# EAGLE design STML451RE_Buck_HSI (EAGLE 9.6.2)

## Sheet 1 of 2
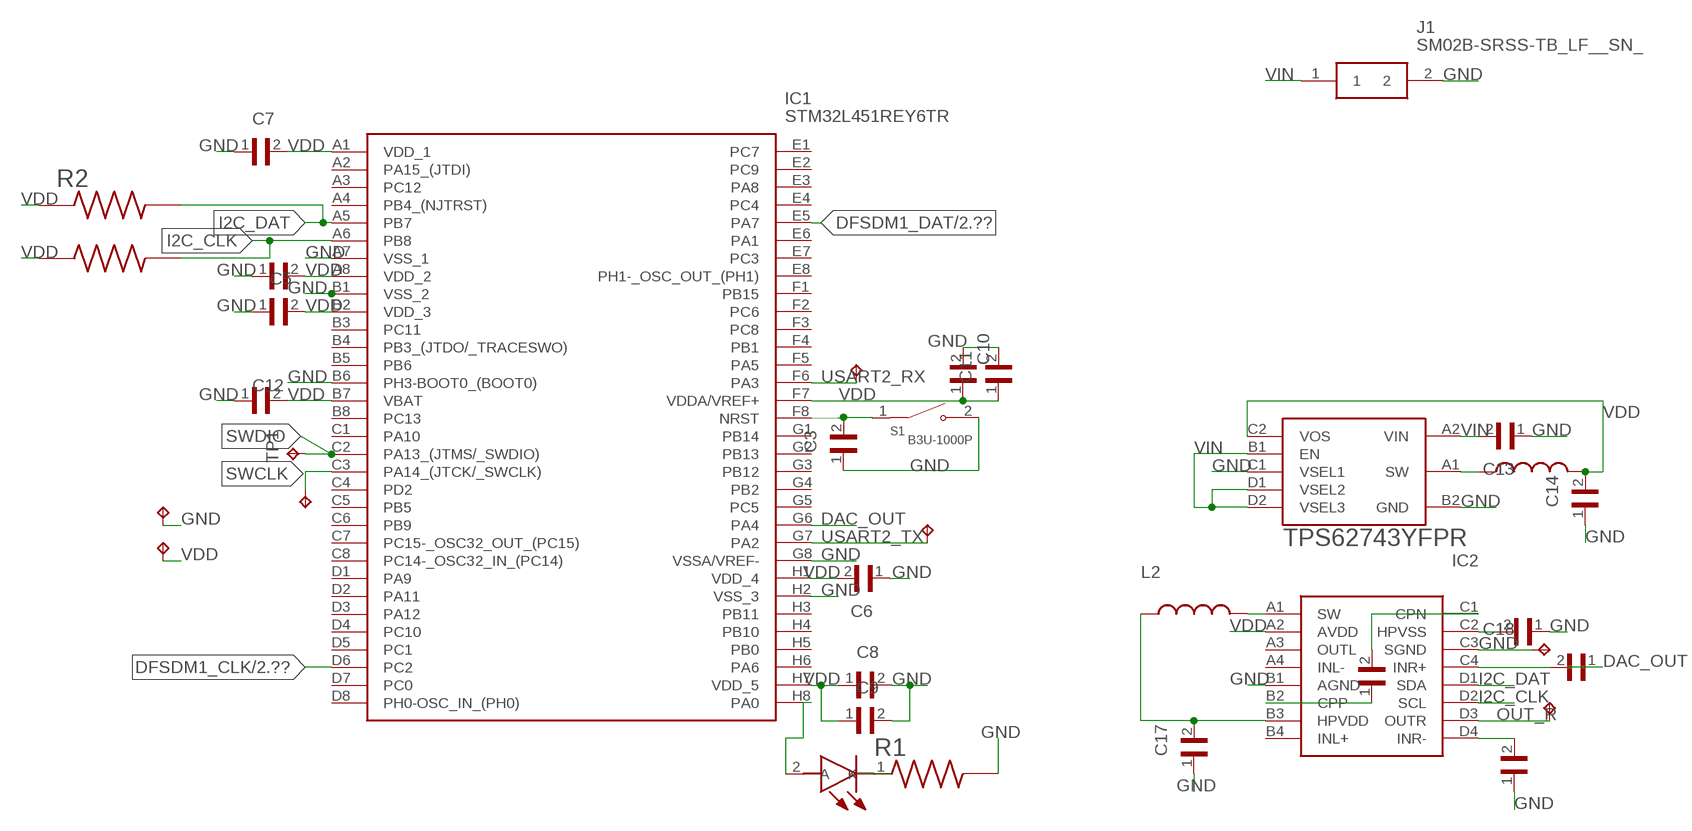
[diagram p0: schematic, sheet 1]

### Parts
C3  GRM033C80J104KE15D  [CAPC0603X33N]
C4  GRM033C80J104KE15D  [CAPC0603X33N]
C5  GRM033C80J104KE15D  [CAPC0603X33N]
C6  GRM033C80J104KE15D  [CAPC0603X33N]
C7  GRM033C80J104KE15D  [CAPC0603X33N]
C8  GRM033C80J104KE15D  [CAPC0603X33N]
C9  GRM155R60J475ME47D  [CAPC1005X60N]
C10  GRM033C80J104KE15D  [CAPC0603X33N]
C11  JMK105C6105KV-F  [CAPC1005X55N]
C12  GRM033C80J104KE15D  [CAPC0603X33N]
C13  GRM155R60J475ME47D  [CAPC1005X60N]
C14  GRM155R60J106ME15D  [CAPC1005X65N]
C17  GRM155R60J225KE95D  [CAPC1005X55N]
C18  GRM155R60J225KE95D  [CAPC1005X55N]
C19  JMK105C6105KV-F  [CAPC1005X55N]
C20  JMK105C6105KV-F  [CAPC1005X55N]
C21  JMK105C6105KV-F  [CAPC1005X55N]
IC1  STM32L451REY6TR  [BGA64C40P8X8_336X366X58]
IC2  TPA6140A2YFFT  [BGA16C40P4X4_156X156X63]
J1  SM02B-SRSS-TB_LF__SN_  [SM02B-SRSS-TB]
L1  1285AS-H-2R2M=P2  [INDC2016X100N]
L2  LQM21PN2R2MC0D  [INDC2012X55N]
LED1  VLMS1500-GS08  [VLMG1500GS08]
R1  CRCW02012K20FKED  [RESC0603X28N]
R2  ERA-2AEB122X  [RESC1005X40N]
R3  ERA-2AEB122X  [RESC1005X40N]
S1  B3U-1000P  [SW_B3U-1000P]
TP1  TPTP11R  [TP11R]
TP2  TPTP11R  [TP11R]
TP3  TPTP11R  [TP11R]
TP4  TPTP11R  [TP11R]
TP5  TPTP11R  [TP11R]
TP6  TPTP11R  [TP11R]
TP7  TPTP11R  [TP11R]
TP8  TPTP11R  [TP11R]
U1  TPS62743YFPR  [BGA8N40P2X4_87X156X50]

### Nets
DAC_OUT: C21.1 IC1.G6(PA4)
DFSDM1_CLK: IC1.D6(PC2) ; also sheet 2
DFSDM1_DAT: IC1.E5(PA7) ; also sheet 2
GND: C3.1 C4.1 C5.1 C6.1 C7.1 C8.2 C9.2 C10.2 C11.2 C12.1 C13.1 C14.1 C17.1 C18.1 C20.1 IC1.A7(VSS_1) IC1.B1(VSS_2) IC1.B6(PH3-BOOT0_(BOOT0)) IC1.G8(VSSA/VREF-) IC1.H2(VSS_3) IC2.B1(AGND) IC2.C3(SGND) J1.2 R1.2 S1.2 TP3.TP TP8.TP U1.B2(GND) U1.C1(VSEL1) ; also sheet 2
I2C_CLK: IC1.A6(PB8) IC2.D2(SCL) R3.2
I2C_DAT: IC1.A5(PB7) IC2.D1(SDA) R2.2
N$1: IC1.F5(PA5)
N$2: IC1.H8(PA0) LED1.2(A)
N$3: IC1.F8(NRST)
N$4: C3.2 S1.1
N$8: LED1.1(K) R1.1
N$9: C17.2 IC2.B3(HPVDD) L2.1
N$10: L1.1 U1.A1(SW)
N$11: IC2.A1(SW) L2.2
N$12: C18.2 IC2.C2(HPVSS)
N$13: C19.1 IC2.B2(CPP)
N$14: C19.2 IC2.C1(CPN)
N$15: C21.2 IC2.C4(INR+)
N$16: C20.2 IC2.D4(INR-)
OSC_OUT: IC1.E8(PH1-_OSC_OUT_(PH1))
OUT_R: IC2.D3(OUTR) TP7.TP
SWCLK: IC1.C3(PA14_(JTCK/_SWCLK)) TP2.TP
SWDIO: IC1.C2(PA13_(JTMS/_SWDIO)) TP1.TP
USART2_RX: IC1.F6(PA3) TP6.TP
USART2_TX: IC1.G7(PA2) TP5.TP
VDD: C4.2 C5.2 C6.2 C7.2 C8.1 C9.1 C10.1 C11.1 C12.2 C14.2 IC1.A1(VDD_1) IC1.A8(VDD_2) IC1.B2(VDD_3) IC1.B7(VBAT) IC1.F7(VDDA/VREF+) IC1.H1(VDD_4) IC1.H7(VDD_5) IC2.A2(AVDD) L1.2 R2.1 R3.1 TP4.TP U1.C2(VOS) ; also sheet 2
VIN: C13.2 J1.1 U1.A2(VIN) U1.B1(EN) U1.D1(VSEL2) U1.D2(VSEL3)
Unconnected: IC1.A2(PA15_(JTDI)) IC1.A3(PC12) IC1.A4(PB4_(NJTRST)) IC1.B3(PC11) IC1.B4(PB3_(JTDO/_TRACESWO)) IC1.B5(PB6) IC1.B8(PC13) IC1.C1(PA10) IC1.C4(PD2) IC1.C5(PB5) IC1.C6(PB9) IC1.C7(PC15-_OSC32_OUT_(PC15)) IC1.C8(PC14-_OSC32_IN_(PC14)) IC1.D1(PA9) IC1.D2(PA11) IC1.D3(PA12) IC1.D4(PC10) IC1.D5(PC1) IC1.D7(PC0) IC1.D8(PH0-OSC_IN_(PH0)) IC1.E1(PC7) IC1.E2(PC9) IC1.E3(PA8) IC1.E4(PC4) IC1.E6(PA1) IC1.E7(PC3) IC1.F1(PB15) IC1.F2(PC6) IC1.F3(PC8) IC1.F4(PB1) IC1.G1(PB14) IC1.G2(PB13) IC1.G3(PB12) IC1.G4(PB2) IC1.G5(PC5) IC1.H3(PB11) IC1.H4(PB10) IC1.H5(PB0) IC1.H6(PA6) IC2.A3(OUTL) IC2.A4(INL-) IC2.B4(INL+)

## Sheet 2 of 2
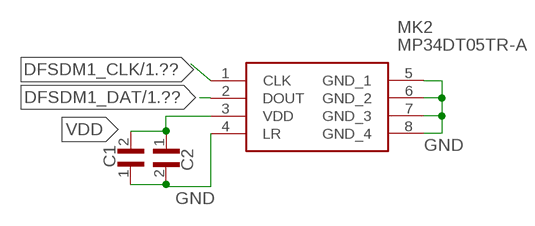
[diagram p1: schematic, sheet 2]

### Parts
C1  GRM033C80J104KE15D  [CAPC0603X33N]
C2  JMK105C6105KV-F  [CAPC1005X55N]
MK2  MP34DT05TR-A  [MP34DT05TRA]

### Nets
DFSDM1_CLK: MK2.1(CLK) ; also sheet 1
DFSDM1_DAT: MK2.2(DOUT) ; also sheet 1
GND: C1.1 C2.2 MK2.4(LR) MK2.5(GND_1) MK2.6(GND_2) MK2.7(GND_3) MK2.8(GND_4) ; also sheet 1
VDD: C1.2 C2.1 MK2.3(VDD) ; also sheet 1

## Library data of the parts
C1 C3-C8 C10 C12 = GRM033C80J104KE15D:GRM033C80J104KE15D: .1UF 6.3V 10% 0201; DESCRIPTION: SMD Capacitor X6S(EIA) with Capacitance: 0.10uF Tol. 10%. Rated Voltage: 6.3Vdc; DIGI-KEY_PART_NUMBER: 490-10390-1-ND; DIGIKEY-PURCHASE-URL: https://snapeda.com/shop?store=DigiKey&id=1836969; MF: Murata Electronics; MP: GRM033C80J104KE15D; PACKAGE: 0603 Taiyo Yuden
C2 C11 C19-C21 = JMK105C6105KV-F:JMK105C6105KV-F: CAP CER 1UF 6.3V X6S 0402; DESCRIPTION: 1µF ±10% 6.3V Ceramic Capacitor X6S 0402 (1005 Metric); DIGI-KEY_PART_NUMBER: 587-3381-1-ND; MF: Taiyo Yuden; MP: JMK105C6105KV-F; PACKAGE: 1005 Taiyo Yuden
C9 C13 = GRM155R60J475ME47D:GRM155R60J475ME47D: Cap Ceramic 4.7uF 6.3V X5R 20% Pad SMD 0402 85°C T/R; DESCRIPTION: SMD Capacitor X5R(EIA) with Capacitance: 4.7uF Tol. 20%. Rated Voltage: 6.3Vdc; DIGI-KEY_PART_NUMBER: 490-5915-1-ND; MF: Murata; MP: GRM155R60J475ME47D; PACKAGE: 1005 Taiyo Yuden
C14 = GRM155R60J106ME15D:GRM155R60J106ME15D: Multilayer Chip Ceramic Capacitor 10µF X5R Surface Mount T/R; DESCRIPTION: SMD Capacitor X5R(EIA) with Capacitance: 10uF Tol. 20%. Rated Voltage: 6.3Vdc; DIGI-KEY_PART_NUMBER: 490-13238-1-ND; MF: Murata; MP: GRM155R60J106ME15D; PACKAGE: 1005 Murata
C17 C18 = GRM155R60J225KE95D:GRM155R60J225KE95D: CAP CER 2.2UF 6.3V X5R 0402; DESCRIPTION: 2.2µF ±10% 6.3V Ceramic Capacitor X5R 0402 (1005 Metric); DIGI-KEY_PART_NUMBER: 490-12532-1-ND; MF: Murata; MP: GRM155R60J225KE95D; PACKAGE: 1005 Taiyo Yuden
IC1 = STM32L451REY6TR:STM32L451REY6TR: ARM Microcontrollers - MCU 16/32-BITS MICROS Source: Datasheet <http://www.st.com/content/ccc/resource/technical/document/datasheet/group3/95/fa/32/09/46/cb/45/35/DM00340475/files/DM00340475.pdf/jcr:content/translations/en.DM00340475.pdf>; DESCRIPTION: ARM Microcontrollers - MCU 16/32-BITS MICROS; HEIGHT: 0.585mm; MANUFACTURER_NAME: STMicroelectronics; MANUFACTURER_PART_NUMBER: STM32L451REY6TR; MOUSER_PART_NUMBER: 511-STM32L451REY6TR; MOUSER_PRICE-STOCK: https://www.mouser.co.uk/ProductDetail/STMicroelectronics/STM32L451REY6TR?qs=Mv7BduZupUg2YTQ5MbUYvA%3D%3D
IC2 = TPA6140A2YFFT:TPA6140A2YFFT: CLASS-G DIRECTPATH STEREO HEADPHONE AMPLIFIER Source: Datasheet; ARROW_PART_NUMBER: TPA6140A2YFFT; DESCRIPTION: CLASS-G DIRECTPATH STEREO HEADPHONE AMPLIFIER; HEIGHT: mm; MANUFACTURER_NAME: Texas Instruments; MANUFACTURER_PART_NUMBER: TPA6140A2YFFT; MOUSER_PART_NUMBER: 595-TPA6140A2YFFT; MOUSER_PRICE-STOCK: https://www.mouser.com/Search/Refine.aspx?Keyword=595-TPA6140A2YFFT
J1 = SM02B-SRSS-TB_LF__SN_:SM02B-SRSS-TB_LF__SN_: CONN HEADER SH 2POS SIDE 1MM TIN Source: Datasheet <http://www.jst-mfg.com/product/pdf/eng/eSH.pdf>; ARROW_PART_NUMBER: SM02B-SRSS-TB(LF)(SN); ARROW_PRICE-STOCK: https://www.arrow.com/en/products/sm02b-srss-tb-lf-sn/jst-manufacturing; DESCRIPTION: CONN HEADER SH 2POS SIDE 1MM TIN; HEIGHT: mm; MANUFACTURER_NAME: JST (JAPAN SOLDERLESS TERMINALS); MANUFACTURER_PART_NUMBER: SM02B-SRSS-TB(LF)(SN)
L1 = 1285AS-H-2R2M_P2:1285AS-H-2R2M=P2: Ind Metal Alloy Shielded 2.2uH 20% 1MHz Powdered Iron 1.2A 0806 T/R; DESCRIPTION: Inductor with Inductance: 2.2uH Tol. +/-20%, Package: 0806 (2016); DIGI-KEY_PART_NUMBER: 490-10600-1-ND; DIGIKEY-PURCHASE-URL: https://snapeda.com/shop?store=DigiKey&id=798775; MF: Murata Electronics; MP: 1285AS-H-2R2M=P2; PACKAGE: 2016 Taiyo Yuden
L2 = LQM21PN2R2MC0D:LQM21PN2R2MC0D: INDUCTOR, 2.2UH, 20%, 0.6A, 50MHZ, 0805; DESCRIPTION: Inductor with Inductance: 2.2uH Tol. +/-20%, Package: 0805 (2012); DIGI-KEY_PART_NUMBER: 490-4994-1-ND; DIGIKEY-PURCHASE-URL: https://snapeda.com/shop?store=DigiKey&id=1501934; MF: Murata; MOUSER-PURCHASE-URL: https://snapeda.com/shop?store=Mouser&id=1501934; MP: LQM21PN2R2MC0D; PACKAGE: 2012 Murata
LED1 = VLMS1500-GS08:VLMS1500-GS08: Vishay 631 nm Red LED, 1005 (0402) SMD package Source: Datasheet <https://componentsearchengine.com/Datasheets/2/VLMS1500-GS08.pdf>; ARROW_PART_NUMBER: VLMS1500-GS08; ARROW_PRICE-STOCK: https://www.arrow.com/en/products/vlms1500-gs08/vishay; DESCRIPTION: Vishay 631 nm Red LED, 1005 (0402) SMD package; HEIGHT: mm; MANUFACTURER_NAME: Vishay; MANUFACTURER_PART_NUMBER: VLMS1500-GS08; MOUSER_PART_NUMBER: 78-VLMS1500-GS08; MOUSER_PRICE-STOCK: https://www.mouser.co.uk/ProductDetail/Vishay-Semiconductors/VLMS1500-GS08?qs=2BArZ0I3QllOybMBfd%252BobQ%3D%3D
MK2 = MP34DT05TR-A:MP34DT05TR-A: STMICROELECTRONICS - MP34DT05TR-A - MEMS MICROPHONE, 3.6V, HCLGA-4 Source: Datasheet <http://www.st.com/content/ccc/resource/technical/document/datasheet/group3/c7/90/d3/f6/b7/e7/40/c8/DM00415595/files/DM00415595.pdf/jcr:content/translations/en.DM00415595.pdf>; DESCRIPTION: STMICROELECTRONICS - MP34DT05TR-A - MEMS MICROPHONE, 3.6V, HCLGA-4; HEIGHT: 1mm; MANUFACTURER_NAME: STMicroelectronics; MANUFACTURER_PART_NUMBER: MP34DT05TR-A; MOUSER_PART_NUMBER: 511-MP34DT05TR-A; MOUSER_PRICE-STOCK: https://www.mouser.com/Search/Refine.aspx?Keyword=511-MP34DT05TR-A
R1 = CRCW02012K20FKED:CRCW02012K20FKED; DESCRIPTION: 2.2 kOhms ±1% 0.05W, 1/20W Chip Resistor 0201 (0603 Metric) Thick Film; DIGI-KEY_PART_NUMBER: 541-2.20KAABCT-ND; DIGIKEY-PURCHASE-URL: https://snapeda.com/shop?store=DigiKey&id=4092052; MF: Vishay; MP: CRCW02012K20FKED; PACKAGE: 0603 Vishay
R2 R3 = ERA-2AEB122X:ERA-2AEB122X; DESCRIPTION: Res Thin Film 0402 1.2K Ohm 0.1% 0.063W(1/16W) ±25ppm/°C Pad SMD Automotive T/R; DIGI-KEY_PART_NUMBER: P1.2KDCCT-ND; DIGIKEY-PURCHASE-URL: https://snapeda.com/shop?store=DigiKey&id=3718075; MF: Panasonic; MOUSER-PURCHASE-URL: https://snapeda.com/shop?store=Mouser&id=3718075; MP: ERA-2AEB122X; PACKAGE: 1005 Panasonic Electronic Components
S1 = B3U-1000P:B3U-1000P: Switch Tactile N.O. SPST Round Button Gull Wing 0.05A 12VDC 1.5N SMD Embossed T/R; DESCRIPTION: Tactile Switch SPST-NO Top Actuated Surface Mount; DIGI-KEY_PART_NUMBER: SW1020CT-ND; DIGIKEY-PURCHASE-URL: https://snapeda.com/shop?store=DigiKey&id=104326; MF: Omron; MP: B3U-1000P; PACKAGE: None
TP1-TP8 = testpad:TP: Test pad
U1 = TPS62743YFPR:TPS62743YFPR: Conv DC-DC Single Step Down 2.15V to 5.5V 8-Pin DSBGA T/R; DESCRIPTION: Buck Switching Regulator IC Positive Programmable 1.2V 1 Output 300mA 8-XFBGA, DSBGA; DIGI-KEY_PART_NUMBER: 296-42392-1-ND; DIGIKEY-PURCHASE-URL: https://snapeda.com/shop?store=DigiKey&id=485129; MF: Texas Instruments; MP: TPS62743YFPR; PACKAGE: DSBGA-8 Texas Instruments

## Board
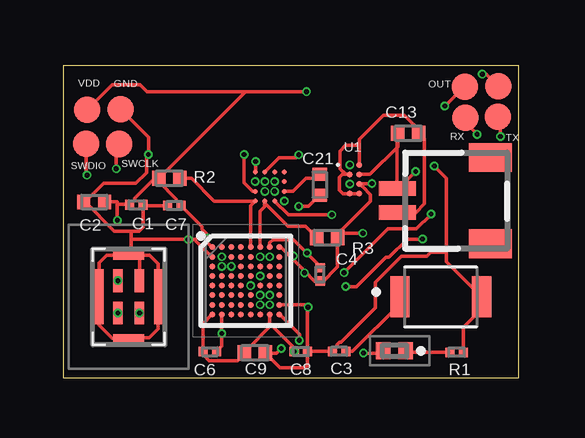
[diagram p2: board, top side]
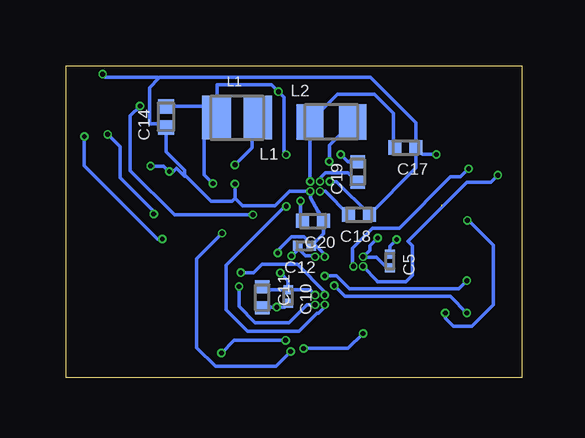
[diagram p3: board, bottom side, seen from below]

Size 19 x 13 mm. Coordinates in mm from the lower left corner, seen from the top.
Outline: 0,0 19,0 19,13 0,13 0,0
Copper layers (1*16): Top 0.035mm / dielectric 1.5mm / Bottom 0.035mm
Design rules "default *": minimum track width 0.15mm, minimum drill 0.2mm, track to track 0.15mm, track to pad 0.1mm, pad to pad 0.1mm, via to via 0.1mm, smd to smd 0.1mm, copper to edge 0.15mm, drill to drill 0.2mm, minimum pad ring 0.1mm, minimum via ring 0.075mm, stop-mask expansion 4mil, vias tented up to drill 0mil, thermal gap 10mil

### Footprints (pad centres in the part's own frame; a part is rotated, then mirrored left to right if it is on the bottom)
CAPC0603X33N = smd 0.38 x 0.4: 1 -0.281,0; 2 0.281,0
CAPC1005X55N = smd 0.54 x 0.6: 1 -0.432,0; 2 0.432,0
CAPC1005X60N = smd 0.56 x 0.63: 1 -0.435,0; 2 0.435,0
CAPC1005X65N = smd 0.6 x 0.67: 1 -0.437,0; 2 0.437,0
BGA64C40P8X8_336X366X58 = smd 0.242 x 0.242: A1 -1.4,1.4; A2 -1,1.4; A3 -0.6,1.4; A4 -0.2,1.4; A5 0.2,1.4; A6 0.6,1.4; A7 1,1.4; A8 1.4,1.4; B1 -1.4,1; B2 -1,1; B3 -0.6,1; B4 -0.2,1; B5 0.2,1; B6 0.6,1; B7 1,1; B8 1.4,1; C1 -1.4,0.6; C2 -1,0.6; C3 -0.6,0.6; C4 -0.2,0.6; C5 0.2,0.6; C6 0.6,0.6; C7 1,0.6; C8 1.4,0.6; D1 -1.4,0.2; D2 -1,0.2; D3 -0.6,0.2; D4 -0.2,0.2; D5 0.2,0.2; D6 0.6,0.2; D7 1,0.2; D8 1.4,0.2; E1 -1.4,-0.2; E2 -1,-0.2; E3 -0.6,-0.2; E4 -0.2,-0.2; E5 0.2,-0.2; E6 0.6,-0.2; E7 1,-0.2; E8 1.4,-0.2; F1 -1.4,-0.6; F2 -1,-0.6; F3 -0.6,-0.6; F4 -0.2,-0.6; F5 0.2,-0.6; F6 0.6,-0.6; F7 1,-0.6; F8 1.4,-0.6; G1 -1.4,-1; G2 -1,-1; G3 -0.6,-1; G4 -0.2,-1; G5 0.2,-1; G6 0.6,-1; G7 1,-1; G8 1.4,-1; H1 -1.4,-1.4; H2 -1,-1.4; H3 -0.6,-1.4; H4 -0.2,-1.4; H5 0.2,-1.4; H6 0.6,-1.4; H7 1,-1.4; H8 1.4,-1.4
BGA16C40P4X4_156X156X63 = smd 0.203 x 0.203: A1 -0.61,0.61; A2 -0.203,0.61; A3 0.203,0.61; A4 0.61,0.61; B1 -0.61,0.203; B2 -0.203,0.203; B3 0.203,0.203; B4 0.61,0.203; C1 -0.61,-0.203; C2 -0.203,-0.203; C3 0.203,-0.203; C4 0.61,-0.203; D1 -0.61,-0.61; D2 -0.203,-0.61; D3 0.203,-0.61; D4 0.61,-0.61
SM02B-SRSS-TB = smd 0.6 x 1.55: 1 1.5,4.575; 2 2.5,4.575 | smd 1.2 x 1.8: 3 0.2,0.7; 4 3.8,0.7
INDC2016X100N = smd 1.2 x 1.82: 1 -0.86,0; 2 0.86,0
INDC2012X55N = smd 1.14 x 1.47: 1 -0.89,0; 2 0.89,0
VLMG1500GS08 = smd 0.6 x 0.7: 1 -0.475,0; 2 0.475,0
MP34DT05TRA = smd 0.4 x 0.95: 1 -0.45,0.675; 2 -0.45,-0.675; 3 0.45,-0.675; 4 0.45,0.675 | smd 0.35 x 2.3: 5 -1.225,0; 6 1.225,0 | smd 1.3 x 0.35: 7 0,1.725; 8 0,-1.725
RESC0603X28N = smd 0.38 x 0.4: 1 -0.28,0; 2 0.28,0
RESC1005X40N = smd 0.56 x 0.64: 1 -0.435,0; 2 0.435,0
SW_B3U-1000P = smd 0.8 x 1.7: 1 -1.7,0; 2 1.7,0
TP11R = smd 1.1 x 1.1: TP 0,0
BGA8N40P2X4_87X156X50 = smd 0.25 x 0.25: A1 -0.2,0.6; A2 0.2,0.6; B1 -0.2,0.2; B2 0.2,0.2; C1 -0.2,-0.2; C2 0.2,-0.2; D1 -0.2,-0.6; D2 0.2,-0.6

### Placement (x,y rotation side)
C1  3.06,7.22 180 top
C2  1.3,7.34 180 top
C3  11.51,1.11 0 top
C4  10.72,4.32 270 top
C5  5.5,4.88 270 bottom
C6  6.12,1.1 180 top
C7  4.64,7.18 0 top
C8  9.92,1.1 0 top
C9  8,1.04 0 top
C10  9.74,3.39 270 bottom
C11  10.82,3.36 270 bottom
C12  9.06,5.51 180 bottom
C13  14.39,10.19 0 top
C14  14.84,10.88 90 bottom
C17  4.85,9.6 180 bottom
C18  6.79,6.81 180 bottom
C19  6.85,8.58 90 bottom
C20  8.71,6.55 180 bottom
C21  10.7,8.05 90 top
IC1  7.62,4.05 0 top
IC2  8.62,7.98 0 top
J1  18.52,5.39 90 top
L1  11.87,10.85 180 bottom
L2  7.94,10.67 0 bottom
LED1  13.82,1.13 180 top
MK2  2.74,3.38 0 top
R1  16.41,1.07 0 top
R2  4.43,8.32 0 top
R3  11.02,5.86 180 top
S1  15.75,3.38 0 top
TP1  0.97,9.76 0 top
TP2  2.34,9.75 0 top
TP3  2.41,11.19 0 top
TP4  1,11.17 0 top
TP5  18.14,10.89 0 top
TP6  16.77,10.85 0 top
TP7  16.75,12.13 0 top
TP8  18.16,12.15 0 top
U1  12.16,8.28 0 top

### Tracks (layer width: path | path; a pad name or v marks a point on that pad's centre or on a via)
DAC_OUT  (via drill 0.2)
  Top 0.15: v9.82,7.15 10.23,7.15 C21.1
  Bottom 0.15: IC1.G6 8.27,3 8.27,2.9 8.47,2.7 8.55,2.7 9.3,1.95 11.44,1.95 12.33,2.84 12.33,4.69 9.87,7.15 v9.82,7.15
  other vias: 8.22,3.05
DFSDM1_CLK  (via drill 0.2)
  Bottom 0.15: IC1.D6 7.73,4.25 7.2,3.71 2.63,3.71 MK2.1
  other vias: 8.22,4.25 2.29,4.05
DFSDM1_DAT  (via drill 0.2)
  Top 0.15: IC1.E5
  Bottom 0.15: MK2.2 2.98,3.4 7.38,3.4 7.63,3.66 IC1.E5 | IC1.E5
  other vias: 2.29,2.71 7.82,3.85
GND  (via drill 0.2, 0.2 pad 0.1)  (1 unrouted)
  Top 0.15: 8.49,1.1 C9.2 | 8.21,1.26 C9.2 | C6.1 6.62,1.33 v6.62,1.85 IC1.H2 | C8.2 10.2,0.51 10.12,0.43 9.04,0.43 C9.2 | IC1.G8 10.12,3.05 v10.22,2.95 10.2,2.93 C8.2 | C4.1 10.72,4.66 v10.18,5.21 9.62,5.76 8.75,5.76 8.62,5.63 IC1.A7 | IC1.B1 6.12,5.15 6.09,5.15 5.53,5.71 5.53,5.78 v5.23,5.78 | v5.22,5.77 v5.23,5.78 | 13.93,7.87 13.93,10.16 C13.1 13.96,9.63 12.8,8.48 U1.B2 | J1.2 13.93,7.87 | 13.93,7.87 13.93,7.83 v14.7,8.6 | C8.2 10.21,1.11 C3.1 11.43,1.31 11.43,1.38 11.53,1.49 11.59,1.49 13.03,2.92 13.03,3.98 14.11,5.07 15.16,5.07 15.34,5.24 15.98,5.24 | v15.48,8.83 15.98,8.33 15.98,5.24 | 15.98,5.24 15.98,4.85 S1.2 17.45,2.87 16.69,2.11 R1.2 | 4.34,7.16 C7.1 3.38,7.18 C1.1 | 0.92,7.34 1.69,8.11 3.03,8.11 3.48,8.56 3.48,9.23 v3.56,9.31 3.56,10.04 TP3.TP 3.08,10.52 | v5.23,5.78 2.87,5.78 2.84,5.75 | 3.21,5.11 3.62,5.11 3.96,4.76 MK2.6 3.96,2.05 3.59,1.68 2.76,1.68 MK2.8 2.05,1.66 1.51,2.19 MK2.5 1.51,4.79 1.83,5.11 MK2.7 | 3.21,5.11 2.79,5.11 | 2.79,5.11 MK2.7 | MK2.4 3.19,5.08 3.21,5.11 | 0.92,7.34 C2.2 | 2.84,6.12 2.13,6.12 0.92,7.34 | 2.84,6.12 2.84,5.75 | 2.84,5.75 2.84,5.21 MK2.7 | MK2.7 | 3.34,7.16 3.34,6.29 3.17,6.12 2.84,6.12 | 2.79,5.16 2.79,5.11 | C9.2 8.91,1.04 v9.1,1.23 | v17.48,12.66 17.65,12.66 TP8.TP
  Bottom 0.15: C10.2 9.9,2.95 v10.22,2.95 10.8,2.95 C11.2 | v5.22,5.77 5.5,5.49 C5.1 | U1.C1 11.96,7.49 | 11.96,7.49 12.09,7.36 12.96,7.36 14.07,8.47 | 14.07,8.47 14.07,8.4 14.4,8.73 14.54,8.6 v14.7,8.6 14.93,8.83 v15.48,8.83 | 14.07,8.47 14.07,8.65 14.84,9.42 C14.1 14.99,10.59 15.52,10.59 15.53,10.61 15.53,12.1 15.14,12.49 | C12.1 8.58,5.51 8.22,5.15 IC1.B6 | 11.96,7.49 11.64,7.17 10.3,7.17 9.69,7.78 IC2.C3 8.82,7.51 8.5,6.95 | 8.59,7.1 8.5,6.95 | 8.5,6.95 C20.1 8.28,6.01 C12.1 | IC2.B1 7.72,8.18 C18.1 4.42,8.75 C17.1 | 15.14,12.49 15.1,12.53 6.31,12.53 4.42,10.64 C17.1 | C17.1 4.15,9.33 3.58,9.33 v3.56,9.31 | v10.18,5.21 10.18,5.31 9.6,5.88 9.08,5.88 8.98,5.78 8.98,5.71 C12.1 | v9.1,1.23 7.24,1.23 v6.62,1.85 | 15.14,12.49 15.18,12.53 17.38,12.53 17.48,12.63 v17.48,12.66
  other vias: 11.96,8.08 8.22,5.05 8.82,7.78 8.01,8.18
I2C_CLK
  Top 0.15: IC1.A6 8.22,6.94 8.41,7.14 8.41,7.31 9.39,6.33 10.11,6.33 R3.2 | 8.38,7.34 IC2.D2
I2C_DAT
  Top 0.15: IC1.A5 7.82,7.18 | IC2.D1 6.3,7.37 5.35,8.32 R2.2
  Top 0.152: 7.82,7.18 IC2.D1
N$2  (via drill 0.2)
  Top 0.15: IC1.H8 9.85,1.82 v9.85,1.57 | LED1.2 13.26,1.04 v12.53,1.04
  Bottom 0.15: v9.85,1.57 11.99,1.57 v12.53,1.04
N$4
  Top 0.15: S1.1 14.05,3.08 12.08,1.11 C3.2
N$8
  Top 0.15: R1.1 14.36,1.07 LED1.1
N$9  (via drill 0.2)
  Bottom 0.15: C17.2 5.35,9.67 5.35,11.02 6.14,11.81 7.68,11.81 L2.1 IC2.B3
  other vias: 8.82,8.18
N$10  (via drill 0.2)
  Bottom 0.15: U1.A1 11.25,9.59 11.25,10.61 L1.1
  other vias: 11.96,8.88
N$11  (via drill 0.2)
  Top 0.15: IC2.A1 8.03,8.61 v8.03,9.02
  Bottom 0.15: v8.03,9.02 8.03,9.69 L2.2
N$12  (via drill 0.2)
  Bottom 0.15: IC2.C2 8.19,7.78 C18.2
  other vias: 8.42,7.78
N$13  (via drill 0.2)
  Bottom 0.152: IC2.B2 8.42,8.32 8.19,8.55 7.25,8.55 C19.1
  other vias: 8.42,8.18
N$14  (via drill 0.2)
  Top 0.15: v7.55,9.31 7.55,8.14 7.91,7.78 IC2.C1
  Bottom 0.152: C19.2 7.25,9.01 v7.55,9.31
N$15
  Top 0.15: C21.2 10.54,8.32 10.12,8.32 9.58,7.78 IC2.C4
N$16  (via drill 0.2)
  Bottom 0.15: IC2.D4 9.23,6.64 C20.2
  other vias: 9.23,7.37
OUT_R  (via drill 0.2)
  Top 0.15: IC2.D3 9.39,6.8 v11.21,6.8 | v15.92,11.33 16.72,12.13 TP7.TP
  Bottom 0.15: v11.21,6.8 14.48,6.8 16.32,8.64 16.32,10.93 v15.92,11.33
SWCLK  (via drill 0.2)
  Top 0.15: v2.22,8.72 2.22,9.63 TP2.TP
  Bottom 0.15: IC1.C3 7.06,4.69 7.06,5.4 6.22,6.24 5.11,6.24 2.97,8.38 2.56,8.38 v2.22,8.72
  other vias: 7.02,4.65
SWDIO  (via drill 0.2)
  Top 0.15: v1,8.45 0.97,8.48 TP1.TP
  Bottom 0.15: IC1.C2 6.01,4.04 6.01,4.01 4.83,4.01 4.56,4.28 4.56,5.51 4.75,5.7 2.29,8.15 1.29,8.15 v1,8.45
  other vias: 6.62,4.65
USART2_RX  (via drill 0.2)
  Top 0.15: v11.72,4.39 13.55,6.22 14.74,6.22 v15.35,6.83 | v17.27,10.15 16.77,10.65 TP6.TP
  Bottom 0.15: IC1.F6 8.22,3.6 9.35,4.73 10.84,4.73 11.18,4.39 v11.72,4.39 | v15.35,6.83 15.35,6.95 16.75,8.35 16.75,9.63 v17.27,10.15
  other vias: 8.22,3.45
USART2_TX  (via drill 0.2)
  Top 0.15: v14.99,5.79 14.35,5.79 13.6,5.04 13.46,5.04 12.23,3.81 v11.79,3.81 | v18.24,10.06 18.24,10.79 TP5.TP
  Bottom 0.15: IC1.G7 8.96,3.05 9.71,2.3 11.12,2.3 11.8,2.98 v11.8,3.8 v11.79,3.81 | v14.99,5.79 15.19,5.79 18.24,8.84 v18.24,10.06
  other vias: 8.62,3.05
VDD  (via drill 0.2)
  Top 0.15: IC1.H1 5.84,2.27 C6.2 5.84,0.98 6.1,0.72 7.29,0.72 7.57,1 C9.1 | 8.62,2.27 8.62,2.13 7.66,1.17 7.66,1.04 | IC1.H7 8.62,2.27 | C8.1 9.64,1.25 8.62,2.27 | 10.07,4.46 10.49,4.04 C4.2 10.79,3.97 11.45,4.63 R3.1 | 10.07,4.46 9.63,4.9 | 9.63,4.9 9.08,5.45 IC1.A8 | C2.1 2.25,7.34 2.25,7.24 | 2.25,7.24 2.76,7.24 C1.2 2.98,7.42 2.98,7.49 3.87,8.39 4.06,8.39 | v2.27,6.57 2.25,6.59 2.25,7.24 | v12.88,8.1 12.38,8.1 U1.C2 12.46,7.98 12.48,7.98 12.82,7.64 12.82,7.36 11.45,5.99 R3.1 | v9.83,9.3 9.71,9.18 9.01,9.18 IC2.A2 | R2.1 4,8.18 4.72,7.45 4.72,7.38 C7.2 | R2.1 3.85,8.33 | v10.15,11.93 7.6,11.93 | 7.6,11.93 4.06,8.39 | 4.06,8.39 R2.1 | 10.07,4.46 v10.07,4.38 | R3.1 11.62,6.03 v12.5,6.03 | 9.63,4.9 9.63,5.05 v9.61,5.08 | 7.6,11.93 3.52,11.93 3.22,12.22 2.06,12.22 TP4.TP
  Top 0.152: IC1.A1 6.01,5.66 v6.01,5.83 6.01,5.98 5.79,6.2 5.79,6.31 C7.2 | 7.66,1.04 C9.1
  Bottom 0.15: C11.1 10.7,3.67 C10.1 | 8.85,3.67 C10.1 | 6.47,5.05 6.45,5.03 | C5.2 5.63,4.6 6.06,5.03 6.45,5.03 | MK2.3 3.19,2.5 2.86,2.17 2.08,2.17 1.18,3.06 1.18,5.54 2.24,6.6 v2.27,6.57 | v12.88,8.1 13.24,8.46 13.24,10.34 L1.2 | L1.2 13.2,11.32 C14.2 14.62,11.32 | 6.45,5.03 6.6,5.03 IC1.B2 6.34,5.33 6.34,5.5 v6.01,5.83 | IC1.B7 8.65,5.08 9.01,5.08 9.34,5.42 C12.2 9.34,5.34 v9.61,5.08 | v9.83,9.3 9.91,9.38 9.91,11.69 v10.15,11.93 10.43,12.21 12.71,12.21 12.71,10.88 L1.2 | v10.07,4.38 9.74,4.05 C10.1 | v12.5,6.03 13.56,4.97 13.56,1.26 12.78,0.48 10.26,0.48 C8.1
  Bottom 0.152: IC1.F7 8.84,3.67 8.85,3.67
  other vias: 8.62,3.45 3.19,2.71 6.62,5.05 8.62,5.05 9.64,1.1
VIN
  Top 0.15: U1.D2 U1.D1 11.67,7.68 11.53,7.82 11.53,8.35 11.66,8.48 U1.B1 11.8,8.48 11.55,8.73 11.55,9.45 11.79,9.69 12.34,9.69 12.36,9.67 U1.A2 12.36,9.95 13.36,10.95 14.24,10.95 14.82,10.37 C13.2 15.07,9.94 15.07,7.25 14.71,6.89 J1.1

### Text on the board
tNames: VDD | GND | OUT | RX | TX | SWDIO | SWCLK
bNames: L1
silk_names: VDD | GND | OUT | RX | TX | SWDIO | SWCLK | GND | Vin